# EAGLE design lm2665 (EAGLE 7.1.0)
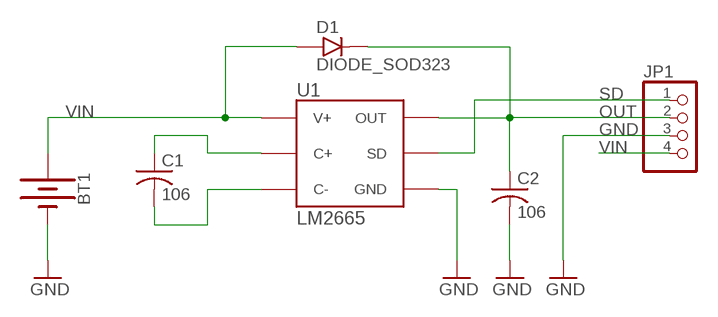
[diagram p0: schematic, sheet 1]

## Parts
BT1  BATTERY-12MM_PTH  [BATTCON_12MM_PTH]
C1  106  C-1206  [1206]
C2  106  C-1206  [1206]
D1  DIODE_SOD323  [SOD-323]
JP1  PINHD-1X04_2.54-S  [1X04-S]
U1  LM2665  [SOT23-6]

## Nets
GND: BT1.GND(-) C2.2(-) JP1.3 U1.2(GND)
N$1: C1.1(+) U1.6(C+)
N$5: C1.2(-) U1.3(C-)
OUT: C2.1(+) D1.C JP1.2 U1.5(OUT)
SD: JP1.1 U1.4(SD)
VIN: BT1.VCC@1(+) D1.A JP1.4 U1.1(V+)

## Library data of the parts
BT1 = SparkFun-Batteries:BATTERY: Battery - Single Cell A variety of battery chemistries, sizes, and footprints. Device List: 20MM_PTH - Coin Cell Battery Holder - 20mm (PTH) <https://www.sparkfun.com/products/783> 12MM_SMD - Coin Cell Battery Holder - 12mm (SMD) <https://www.sparkfun.com/products/10592> 12MM_PTH - Coin Cell Battery Holder - 12mm (PTH) <https://www.sparkfun.com/products/7948> 20MM_SMD - 20mm Coin Cell Battery Holder (SMD) (2 legs) Used on the Big Time Watch Kit <https://www.sparkfun.com/products/11734> 20MM_SMD_4LEGS - Coin Cell Battery Holder - 20mm (SMD) <https://www.sparkfun.com/products/11892> 20MM_SMD_4LEGS_OVERPASTE - Coin Cell Battery Holder - 20mm (SMD) <https://www.sparkfun.com/products/11892> (Over-paste on the legs) 24.5MM_PTH - Coin Cell Battery Holder - 24.5mm (PTH) <https://www.sparkfun.com/products/8863> 9V - 9V Battery Holder - PC Mount Used on the SparkFun SparkPunk Sound Kit <https://www.sparkfun.com/products/11177> and SparkFun SparkPunk Sequencer Kit <https://www.sparkfun.com/products/12707> 18650 - Battery Holder - 18650 (PTH) <https://www.sparkfun.com/products/13113> AA - Battery Holder - 1xAA (PTH) <https://www.sparkfun.com/products/7949> AAA - Battery Holder - 1xAAA (PTH) <https://www.sparkfun.com/products/12718> AA_KIT - Battery Holder - 1xAA (PTH) <https://www.sparkfun.com/products/7949> Special kit package - pads only have exposed copper on one side of the board. AAA_KIT - Battery Holder - 1xAAA (PTH) <https://www.sparkfun.com/products/12718> Special kit package - pads only have exposed copper on one side of the board.; PROD_ID: BATT-08315; SF_SKU: PRT-07948
C1 C2 = bt_rcl:C: Capacitor, non-polarized, American symbol
D1 = bt_diode:DIODE: Diode Collection of generic diodes in various packages
JP1 = pinhead-2:PINHD-1X04: PIN HEADER
U1 = bt_regulator:LM2665: LM2665 - Switched Capacitor Voltage Converter The LM2665 CMOS charge-pump voltage converter operates as a voltage doubler for an input voltage in the range of 2.5 V to 5.5 V. Two low-cost capacitors and a diode (needed during start-up) are used in this circuit to provide up to 40 mA of output current. The LM2665 can also work as a voltage divider to split a voltage in the range of 1.8 V to 11 V in half. The LM2665 operates at 160-kHz oscillator frequency to reduce output resistance and voltage ripple. With an operating current of only 650 μA (operating efficiency greater than 90% with most loads) and 1-μA typical shutdown current, the LM2665 provides ideal performance for battery powered systems.

## Board
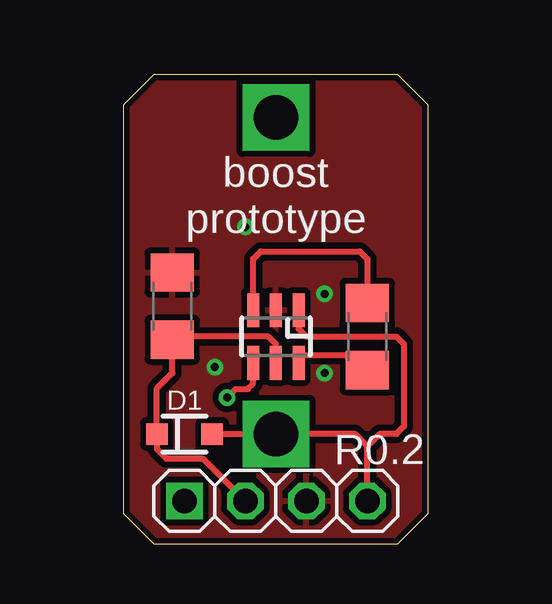
[diagram p1: board, top side]
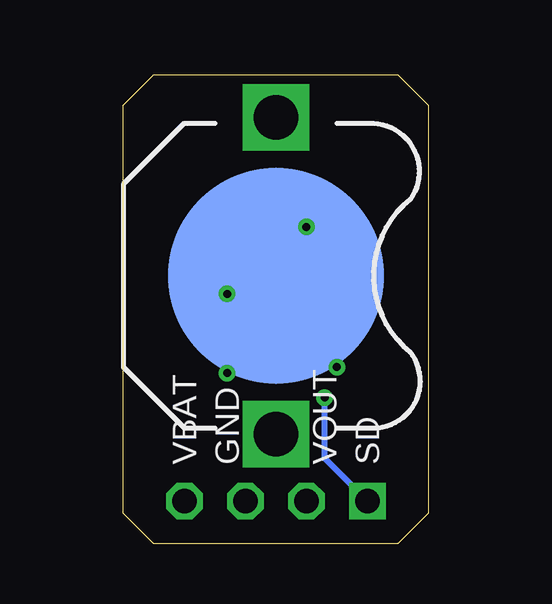
[diagram p2: board, bottom side, seen from below]

Size 12.7 x 19.56 mm. Coordinates in mm from the lower left corner, seen from the top.
Outline: 0,18.29 0,1.27 1.27,0 11.43,0 12.7,1.27 12.7,18.29 11.43,19.56 1.27,19.56 0,18.29
Copper layers (1*16): Top 0.0356mm / dielectric 1.5011mm / Bottom 0.0356mm
Design rules "LaenPCBOrder": minimum track width 6mil, minimum drill 13mil, track to track 10mil, track to pad 10mil, pad to pad 10mil, via to via 10mil, smd to smd 8mil, copper to edge 10mil, drill to drill 10mil, minimum pad ring 7mil, minimum via ring 7mil, stop-mask expansion 3mil, vias tented up to drill 20mil, thermal gap 10mil

### Footprints (pad centres in the part's own frame; a part is rotated, then mirrored left to right if it is on the bottom)
BATTCON_12MM_PTH = smd 9 x 9: GND 0,0 | drill 1.854 square: VCC@1 6.604,0; VCC@2 -6.604,0
1206 = smd 1.6 x 1.8: 1 -1.4,0; 2 1.4,0
SOD-323 = smd 0.9 x 0.9: A 1.15,0; C -1.15,0
1X04-S = drill 1.016 square: 1 -3.81,0 | drill 1.016 octagon: 2 -1.27,0; 3 1.27,0; 4 3.81,0
SOT23-6 = smd 0.5 x 1.4: 1 -0.95,-1.1; 2 0,-1.1; 3 0.95,-1.1; 4 0.95,1.1; 5 0,1.1; 6 -0.95,1.1

### Placement (x,y rotation side)
BT1  6.35,11.18 270 bottom
C1  10.16,8.64 90 top
C2  2.03,9.91 90 top
D1  2.54,4.57 0 top
JP1  6.35,1.78 0 top
U1  6.35,8.64 180 top

### Tracks (layer width: path | path; a pad name or v marks a point on that pad's centre or on a via)
GND  (via drill 0.33)
  Bottom 0.254: BT1.GND 6.86,11.18 v8.38,10.41 | BT1.GND 6.35,11.94 v5.08,13.21 | v8.38,7.11 BT1.GND | v3.81,7.37 6.35,9.91 BT1.GND
  pour Top: 1.27,19.56 12.7,19.56 12.7,1.27 11.43,0 1.27,0 0,1.27 0,18.29
N$1
  Top 0.254: U1.6 7.37,7.54 7.37,7.87 10.16,7.87 C1.1
N$5
  Top 0.254: U1.3 5.4,11.87 5.72,12.19 9.84,12.19 10.16,11.87 C1.2
OUT
  Top 0.254: U1.5 6.35,8.32 6.03,8.64 2.67,8.64 C2.1 2.03,7.11 1.39,6.47 D1.C 1.39,3.94 1.78,3.56 3.3,3.56 JP1.2
SD  (via drill 0.33)
  Top 0.254: v4.32,6.1 4.67,6.45 5.18,6.45 5.4,6.67 U1.4
  Bottom 0.254: v4.32,6.1 4.32,3.56 JP1.1
VIN
  Top 0.254: U1.1 7.3,8.95 7.62,8.64 11.37,8.64 11.68,8.32 11.68,4.89 11.37,4.57 10.67,4.57 10.16,4.06 | 10.16,4.06 10.16,3.81 JP1.4 | 10.16,4.06 9.65,4.57 BT1.VCC@1 D1.A

### Text on the board
tNames: boost / prototype | R0.2
bNames: SD | VOUT | GND | VBAT